# Altium schematic sheet Power.SchDoc
size A4; SheetNumber: 3; SheetTotal: 3
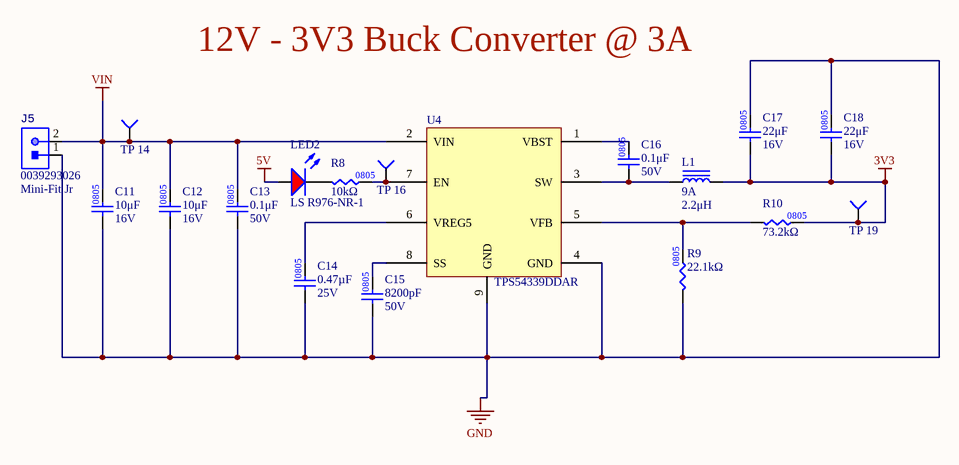
[diagram p0: Power.SchDoc]

## Parts
C11  value 10μF  Voltage Rating: 16V  [CAP0805]  (hidden comment: CAP_10uF_16V_0805)
C12  value 10μF  Voltage Rating: 16V  [CAP0805]  (hidden comment: CAP_10uF_16V_0805)
C13  value 0.1μF  Voltage Rating: 50V  [CAP0805]  (hidden comment: CAP_0.1uF_50V_0805)
C14  value 0.47µF  Voltage Rating: 25V  [CAP0805]  (hidden comment: CAP_0.47uF_25V_0805)
C15  Capacitance: 8200pF  Voltage Rating: 50V  [CAP0805]  (hidden comment: CAP_8200pF_50V_0805)
C16  value 0.1μF  Voltage Rating: 50V  [CAP0805]  (hidden comment: CAP_0.1uF_50V_0805)
C17  value 22μF  Voltage Rating: 16V  [CAP2012]  (hidden comment: CAP_22uF_16V_0805)
C18  value 22μF  Voltage Rating: 16V  [CAP2012]  (hidden comment: CAP_22uF_16V_0805)
J5  Family: Mini-Fit Jr  [0039293026]  (hidden comment: CONN_0039293026)
L1  Current Rating: 9A  Inductance: 2.2μH  [IND_BOURNS_SDR1806]  (hidden comment: IND_2.2uH_9A)
LED2  Manufacturer Part Number 1: LS R976-NR-1  [LED_0805_RED]  (hidden comment: LED_RED)
R8  value 10kΩ  [RES0805]  (hidden comment: RES_10kΩ_0805_5%)
R9  value 22.1kΩ  [RES0805]  (hidden comment: RES_22.1kΩ_0805_1%)
R10  value 73.2kΩ  [RES0805]  (hidden comment: RES_73.2kΩ_0805_1%)
TP_14  TESTPOINT_1MM_CIRCLE  [TESTPOINT_CIRCLE_1MM]  (value not drawn)  (no BOM)
TP_16  TESTPOINT_1MM_CIRCLE  [TESTPOINT_CIRCLE_1MM]  (value not drawn)  (no BOM)
TP_19  TESTPOINT_1MM_CIRCLE  [TESTPOINT_CIRCLE_1MM]  (value not drawn)  (no BOM)
U4  Manufacturer Part Number 1: TPS54339DDAR  [VREG_LM5017MR/NOPB]  (hidden comment: TPS54339)

## Nets
3V3: C17.1 C18.1 L1.2 R10.2 TP_19.1(=value)
5V: LED2.1(A)
GND: C11.1 C12.1 C13.1 C14.1 C15.1 C17.2 C18.2 J5.1 R9.1 U4.4(GND) U4.9(GND)
VIN: C11.2 C12.2 C13.2 J5.2 TP_14.1(=value) U4.2(VIN)
NetC14_2: C14.2 U4.6(VREG5)
NetC15_2: C15.2 U4.8(SS)
NetC16_1: C16.1 L1.1 U4.3(SW)
NetC16_2: C16.2 U4.1(VBST)
NetLED2_2: LED2.2(K) R8.1
NetR8_2: R8.2 TP_16.1(=value) U4.7(EN)
NetR9_2: R9.2 R10.1 U4.5(VFB)

## Notes on the sheet
- 12V - 3V3 Buck Converter @ 3A
- (in symbol RES_22.1kΩ_0805_1%) 0805

## Library data of the parts
C11 C12 = CAP_10uF_16V_0805: CAP CER 10UF 16V X5R 0805; Manufacturer 1: Yageo; Manufacturer Part Number 1: CC0805KKX5R7BB106; Package/Footprint: 0805; Mounting Type: SMD; Supplier 1: Digi-Key; Supplier Part Number 1: 311-1865-1-ND; Dielectric: X5R
C13 C16 = CAP_0.1uF_50V_0805: CAP CER 0.1UF 50V X7R 0805; Manufacturer 1: Murata Electronics; Manufacturer Part Number 1: GCM21BR71H104KA37K; Package/Footprint: 0805; Mounting Type: SMD; Supplier 1: Digi-Key; Supplier Part Number 1: 490-8049-1-ND; Dielectric: X7R; LCSC Part #: C49678
C14 = CAP_0.47uF_25V_0805: CAP CER 0.47UF 25V X5R 0805; Manufacturer 1: KEMET; Manufacturer Part Number 1: C0805C474K3PAC7800; Package: 0805; Supplier 1: Digi-Key; Supplier Part Number 1: 399-15508-1-ND
C15 = CAP_8200pF_50V_0805: CAP CER 8200PF 50V X7R 0805; Manufacturer: YAGEO; Manufacturer Part Number: CC0805KRX7R9BB822; Mounting Type: SMD; Package: 0805; Supplier 1: Digi-Key; Supplier Part Number 1: 311-4331-1-ND; Dielectric: X7R
C17 C18 = CAP_22uF_16V_0805: CAP CER 22UF 16V X5R 0805; Manufacturer 1: Murata Electronics; Manufacturer Part Number 1: GRM219R61C226ME15L; Package/Footprint: 0805; Mounting Type: SMD; Supplier 1: Digi-Key; Supplier Part Number 1: 490-9952-1-ND; Dielectric: X5R
J5 = CONN_0039293026: CONN HEADER VERT 2POS MINI-FIT; Manufacturer 1: Molex; Package/Footprint: TH; Supplier 1: Digi-Key; Mounting Type: TH; Supplier Part Number 1: WM3843-ND; Verified: No; Manufacturer Part Number 1: 0039293026
L1 = IND_2.2uH_9A: INDUCTOR 2.2UH 9A 6.8 MOHM SMD; Manufacturer 1: Bourns; Manufacturer Part Number 1: SDR1806-2R2ML; Supplier 1: Digi-Key; Mounting Type: SMD; DC Resistance (DCR): 6.8mOhm; Supplier Part Number 1: SDR1806-2R2MLCT-ND
LED2 = LED_RED: LED RED DIFFUSED 0805 SMD; Manufacturer 1: OSRAM; Package/Footprint: 0805; Forward Voltage Drop: 2V; Forward Current: 20mA; Supplier Part Number 1: 475-1278-1-ND; Supplier 1: Digi-Key; Mounting Type: SMD
R8 = RES_10kΩ_0805_5%: RES 10K OHM 5% 1/8W 0805; Manufacturer 1: Panasonic Electronic Components; Manufacturer Part Number 1: ERJ-6GEYJ103V; Package/Footprint: 0805; Supplier 1: Digi-Key; Supplier Part Number 1: P10KACT-ND; LCSC Part #: C17414; Mounting Type: SMD
R9 = RES_22.1kΩ_0805_1%: RES 22.1K OHM 1% 1/8W 0805; Manufacturer 1: Vishay Dale; Manufacturer Part Number 1: CRCW080522K1FKEA; Supplier 1: Digi-Key; Supplier Part Number 1: 541-22.1KCCT-ND
R10 = RES_73.2kΩ_0805_1%: RES 73.2K OHM 1% 1/8W 0805; Manufacturer 1: Yageo; Manufacturer Part Number 1: RC0805FR-0773K2L; Package/Footprint: 0805; Mounting Type: SMD; Supplier 1: Digi-Key; Supplier Part Number 1: 311-73.2KCRCT-ND
TP_14 TP_16 TP_19 = TESTPOINT_1MM_CIRCLE: TESTPOINT 1MM CIRCLE
U4 = TPS54339: IC REG BUCK ADJUSTABLE 3A 8SOPWR; Manufacturer 1: Texas Instruments; Input Voltage (Min): 4.5V; Input Voltage (Max): 23V; Output Voltage (Min/Fixed): 0.76V; Output Voltage (Max): 7V; Switching Frequency: 600kHz; Supplier 1: Digi-Key; Supplier Part Number 1: 296-35686-1-ND; Output Current: 3A; Package: 8-PowerSOIC